# Altium project vga.PrjPcb
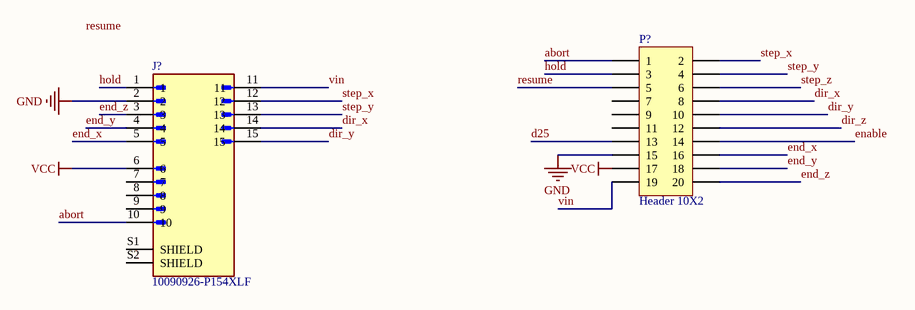
[diagram p0: vga.SchDoc]
1 sheet, 2 parts. Net scope: global (net labels, ports and power ports of the same name join across sheets).
Board file: vga.PcbDoc

## Sheet vga.SchDoc
size A

### Parts
J?  10090926-P154XLF  [AMPHENOL_10090926-P154XLF]
P?  Header 10X2  [HDR2X10]

### Nets
GND: J?.2 P?.15
VCC: J?.6 P?.17
abort: J?.10 P?.1
d25: P?.13
dir_x: J?.14 P?.8
dir_y: J?.15 P?.10
dir_z: P?.12
enable: P?.14
end_x: J?.5 P?.16
end_y: J?.4 P?.18
end_z: J?.3 P?.20
hold: J?.1 P?.3
resume: P?.5
step_x: J?.12 P?.2
step_y: J?.13 P?.4
step_z: P?.6
vin: J?.11 P?.19

Not connected (* = marked no-connect by the designer): J? 7 8 9 S1(SHIELD) S2(SHIELD); P? 7 9 11

### Notes on the sheet
- Labels drawn without touching a wire or pin: resume

### Library data of the parts
J? = 10090926-P154XLF: Conn High Density D-Sub PIN 15 POS 2.29mm Solder RA Thru-Hole 15 Terminal 1 Port; MF: Amphenol; Package: None; Price: None; Check_prices: https://www.snapeda.com/parts/10090926-P154XLF/Amphenol/view-part/?ref=eda; Value: *; SnapEDA_Link: https://www.snapeda.com/parts/10090926-P154XLF/Amphenol/view-part/?ref=snap; MP: 10090926-P154XLF; Availability: In Stock; Purchase-URL: https://pricing.snapeda.com/search?q=10090926-P154XLF&ref=eda
P? = Header 10X2: Header, 10-Pin, Dual row; LatestRevisionDate: 17-Jul-2002; LatestRevisionNote: Re-released for DXP Platform.; Publisher: Altium Limited